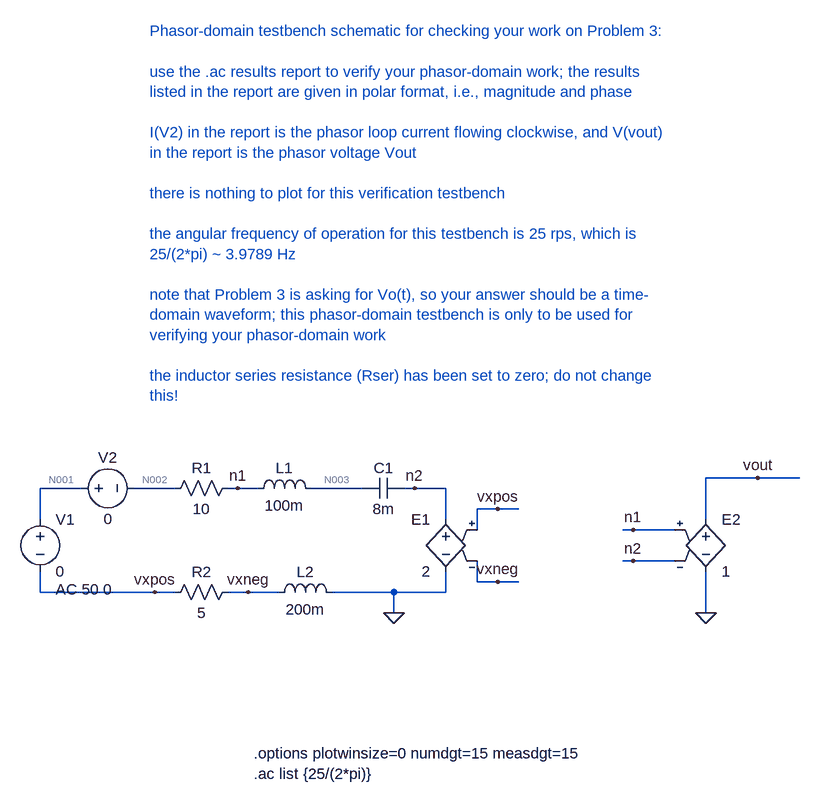
[diagram p0: schematic hw7_prob3.asc]
hw7_prob3.asc, the LTspice schematic file:
Version 4
SHEET 1 880 680
WIRE 448 64 368 64
WIRE 512 64 448 64
WIRE -592 80 -656 80
WIRE -448 80 -512 80
WIRE -352 80 -368 80
WIRE -320 80 -352 80
WIRE -160 80 -240 80
WIRE -80 80 -96 80
WIRE -32 80 -80 80
WIRE 48 112 16 112
WIRE 80 112 48 112
WIRE -656 128 -656 80
WIRE -32 128 -32 80
WIRE 368 128 368 64
WIRE 16 144 16 112
WIRE 256 144 240 144
WIRE 320 144 256 144
WIRE 256 192 240 192
WIRE 320 192 256 192
WIRE 16 224 16 192
WIRE 48 224 16 224
WIRE 80 224 48 224
WIRE -656 240 -656 208
WIRE -480 240 -656 240
WIRE -448 240 -480 240
WIRE -336 240 -368 240
WIRE -288 240 -336 240
WIRE -112 240 -208 240
WIRE -32 240 -32 208
WIRE -32 240 -112 240
WIRE -112 272 -112 240
WIRE 368 272 368 208
FLAG -112 272 0
FLAG -336 240 vxneg
FLAG -480 240 vxpos
FLAG 48 112 vxpos
FLAG 48 224 vxneg
FLAG -352 80 n1
FLAG -80 80 n2
FLAG 368 272 0
FLAG 256 144 n1
FLAG 256 192 n2
FLAG 448 64 vout
SYMBOL voltage -656 112 R0
WINDOW 123 24 124 Left 2
SYMATTR Value2 AC 50 0
SYMATTR InstName V1
SYMATTR Value 0
SYMBOL res -464 96 R270
WINDOW 0 32 56 VTop 2
WINDOW 3 0 56 VBottom 2
SYMATTR InstName R1
SYMATTR Value 10
SYMBOL voltage -608 80 R270
WINDOW 0 32 56 VTop 2
WINDOW 3 -32 56 VBottom 2
WINDOW 123 0 0 Left 0
WINDOW 39 0 0 Left 0
SYMATTR InstName V2
SYMATTR Value 0
SYMBOL ind -336 96 R270
WINDOW 0 32 56 VTop 2
WINDOW 3 5 56 VBottom 2
SYMATTR InstName L1
SYMATTR Value 100m
SYMATTR SpiceLine Rser=0
SYMBOL cap -96 64 R90
WINDOW 0 0 32 VBottom 2
WINDOW 3 32 32 VTop 2
SYMATTR InstName C1
SYMATTR Value 8m
SYMBOL res -464 256 R270
WINDOW 0 32 56 VTop 2
WINDOW 3 0 56 VBottom 2
SYMATTR InstName R2
SYMATTR Value 5
SYMBOL ind -304 256 R270
WINDOW 0 32 56 VTop 2
WINDOW 3 5 56 VBottom 2
SYMATTR InstName L2
SYMATTR Value 200m
SYMATTR SpiceLine Rser=0
SYMBOL e -32 112 M0
SYMATTR InstName E1
SYMATTR Value 2
SYMBOL e 368 112 R0
SYMATTR InstName E2
SYMATTR Value 1
TEXT -328 488 Left 2 !.options plotwinsize=0 numdgt=15 measdgt=15\n.ac list {25/(2*pi)}
TEXT -488 -624 Left 2 ;Phasor-domain testbench schematic for checking your work on Problem 3:\n \nuse the .ac results report to verify your phasor-domain work; the results\nlisted in the report are given in polar format, i.e., magnitude and phase\n \nI(V2) in the report is the phasor loop current flowing clockwise, and V(vout) \nin the report is the phasor voltage Vout\n \nthere is nothing to plot for this verification testbench\n \nthe angular frequency of operation for this testbench is 25 rps, which is \n25/(2*pi) ~ 3.9789 Hz\n \nnote that Problem 3 is asking for Vo(t), so your answer should be a time-\ndomain waveform; this phasor-domain testbench is only to be used for \nverifying your phasor-domain work\n \nthe inductor series resistance (Rser) has been set to zero; do not change \nthis!

The netlist it stands for:
* hw7_prob3.asc
V1 N001 vxpos 0 AC 50 0
R1 N002 n1 10
V2 N001 N002 0
L1 n1 N003 100m Rser=0
C1 n2 N003 8m
R2 vxpos vxneg 5
L2 vxneg 0 200m Rser=0
E1 n2 0 vxpos vxneg 2
E2 vout 0 n1 n2 1
.options plotwinsize=0 numdgt=15 measdgt=15
.ac list {25/(2*pi)}
* Phasor-domain testbench schematic for checking your work on Problem 3:
* use the .ac results report to verify your phasor-domain work; the results
* listed in the report are given in polar format, i.e., magnitude and phase
* I(V2) in the report is the phasor loop current flowing clockwise, and V(vout)
* in the report is the phasor voltage Vout
* there is nothing to plot for this verification testbench
* the angular frequency of operation for this testbench is 25 rps, which is
* 25/(2*pi) ~ 3.9789 Hz
* note that Problem 3 is asking for Vo(t), so your answer should be a time-
* domain waveform; this phasor-domain testbench is only to be used for
* verifying your phasor-domain work
* the inductor series resistance (Rser) has been set to zero; do not change
* this!
.backanno
.end

* Results of the author's LTspice run, read from the files saved beside the schematic
* AC Analysis:
*   frequency = 3.979 
*   V(n001) = -10 V
*   V(vxpos) = -60 V
*   V(n002) = -10 V
*   V(n1) = -90 V
*   V(n003) = -100 V
*   V(n2) = -80 V
*   V(vxneg) = -20 V
*   V(vout) = -10 V
*   I(C1) = -8 A
*   I(L1) = 8 A
*   I(L2) = -8 A
*   I(R1) = 8 A
*   I(R2) = -8 A
*   I(E1) = 8 A
*   I(E2) = 0 A
*   I(V1) = -8 A
*   I(V2) = 8 A